# EAGLE design hacker-boards-refactor (EAGLE 7.5.0)
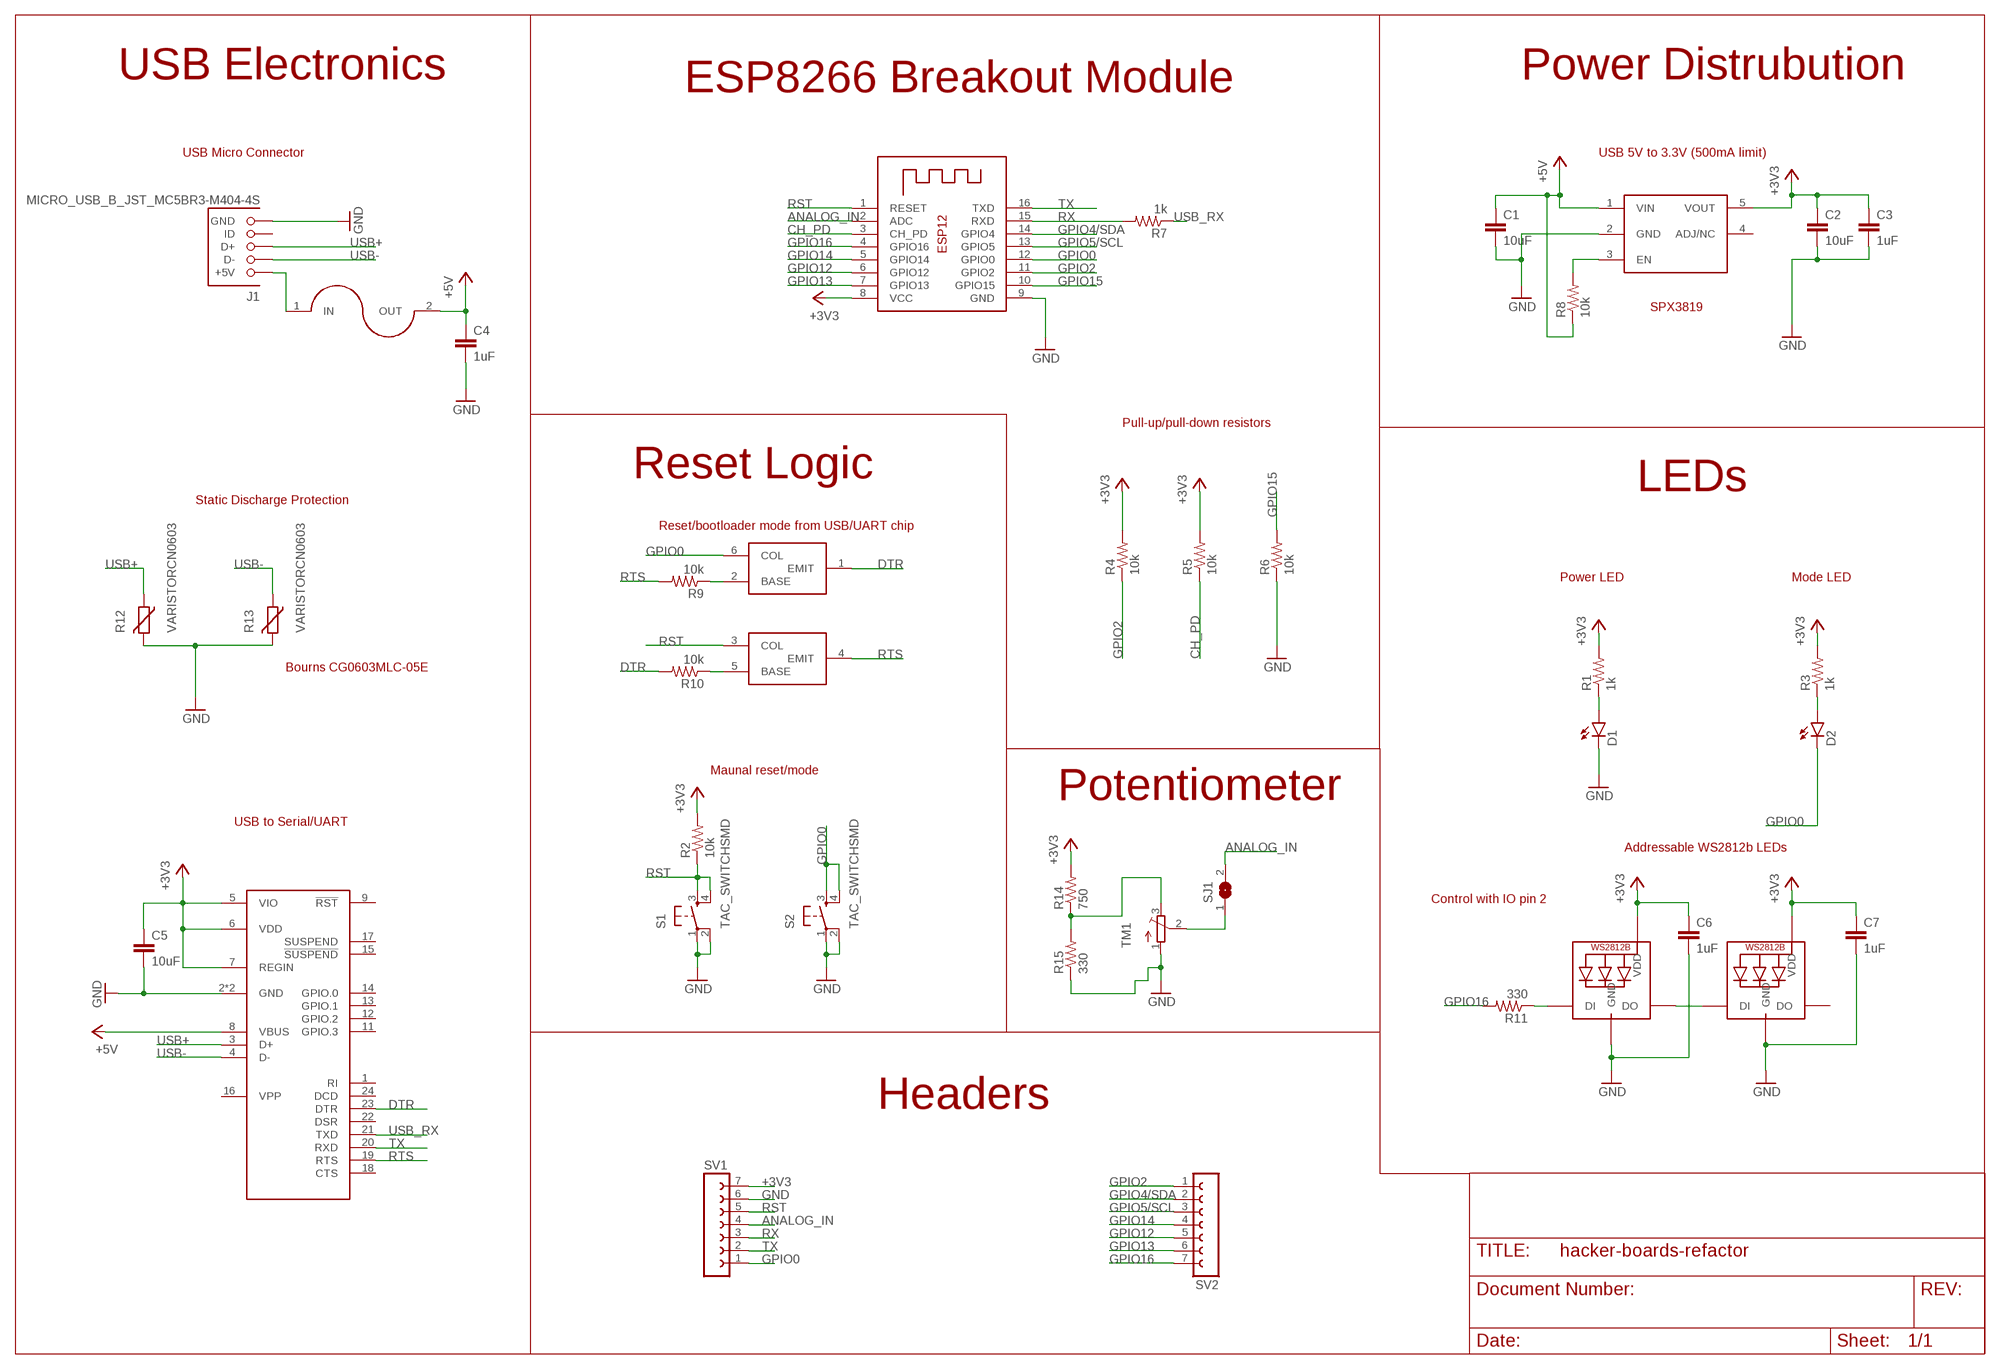
[diagram p0: schematic, sheet 1]

## Parts
C1  10uF  C0805  [C0805]
C2  10uF  C0805  [C0805]
C3  1uF  C0805  [C0805]
C4  1uF  C0805  [C0805]
C5  10uF  C0805  [C0805]
C6  1uF  C0805  [C0805]
C7  1uF  C0805  [C0805]
D1  LED0603  [LED-0603]
D2  LED0603  [LED-0603]
J1  MICRO_USB_B_JST_MC5BR3-M404-4S  [USB_MICRO_B-JST-MC5BR3-M404-4S-TB]
LED1  WS2812B5050  [WS2812B]
LED2  WS2812B5050  [WS2812B]
R1  1k  R-US_R0805  [R0805]
R2  10k  R-US_R0805  [R0805]
R3  1k  R-US_R0805  [R0805]
R4  10k  R-US_R0805  [R0805]
R5  10k  R-US_R0805  [R0805]
R6  10k  R-US_R0805  [R0805]
R7  1k  R-US_R0805  [R0805]
R8  10k  R-US_R0805  [R0805]
R9  10k  R-US_R0805  [R0805]
R10  10k  R-US_R0805  [R0805]
R11  330  R-US_R0805  [R0805]
R12  VARISTORCN0603  [CT/CN0603]
R13  VARISTORCN0603  [CT/CN0603]
R14  750  R-US_R0805  [R0805]
R15  330  R-US_R0805  [R0805]
S1  TAC_SWITCHSMD  [TACTILE-SWITCH-SMD]
S2  TAC_SWITCHSMD  [TACTILE-SWITCH-SMD]
SJ1  SJ  [SJ]
SV1  FE07-1  [FE07]
SV2  FE07-1  [FE07]
TM1  TRIMPOTTC33X  [TC33X]
U$1  USB-FUSE  [L1812]
U$2  AP2112  [SOT23-5L]
U$3  CP2104  [QFN24_4X4]
U$4  MBT3904DW1T1G  [SOT363]
X1  ESP-12  [ESP-12]

## Nets
+3V3: C2.1 C3.1 C5.1 C6.1 C7.1 LED1.1-VDD(VDD) LED2.1-VDD(VDD) R1.2 R2.2 R3.2 R4.2 R5.2 R14.2 SV1.7 U$2.5(VOUT) U$3.5(VIO) U$3.6(VDD) U$3.7(REGIN) X1.8(VCC)
+5V: C1.1 C4.1 R8.1 U$1.2(OUT) U$2.1(VIN) U$3.8(VBUS)
ANALOG_IN: SJ1.2 SV1.4 X1.2(ADC)
CH_PD: R5.1 X1.3(CH_PD)
DTR: R10.2 U$3.23(DTR) U$4.1(EMIT)
GND: C1.2 C2.2 C3.2 C4.2 C5.2 C6.2 C7.2 D1.C J1.5(GND) LED1.3-GND(GND) LED2.3-GND(GND) R6.1 R12.2 R13.2 R15.1 S1.1 S1.2 S2.1 S2.2 SV1.6 TM1.1(A) U$2.2(GND) U$3.2(GND) U$3.25(GND) X1.9(GND)
GPIO0: D2.C S2.3 S2.4 SV1.1 U$4.6(COL) X1.12(GPIO0)
GPIO2: R4.1 SV2.1 X1.11(GPIO2)
GPIO4/SDA: SV2.2 X1.14(GPIO4)
GPIO5/SCL: SV2.3 X1.13(GPIO5)
GPIO12: SV2.5 X1.6(GPIO12)
GPIO13: SV2.6 X1.7(GPIO13)
GPIO14: SV2.4 X1.5(GPIO14)
GPIO15: R6.2 X1.10(GPIO15)
GPIO16: R11.2 SV2.7 X1.4(GPIO16)
N$1: D1.A R1.1
N$2: J1.1(+5V) U$1.1(IN)
N$3: D2.A R3.1
N$4: R14.1 R15.2 TM1.3(E)
N$5: LED1.2-DOUT(DO) LED2.4-DIN(DI)
N$6: LED1.4-DIN(DI) R11.1
N$7: R8.2 U$2.3(EN)
N$8: R9.1 U$4.2(BASE)
N$11: R10.1 U$4.5(BASE)
N$12: SJ1.1 TM1.2(S)
RST: R2.1 S1.3 S1.4 SV1.5 U$4.3(COL) X1.1(RESET)
RTS: R9.2 U$3.19(RTS) U$4.4(EMIT)
RX: R7.2 SV1.3 X1.15(RXD)
TX: SV1.2 U$3.20(RXD) X1.16(TXD)
USB+: J1.3(D+) R12.1 U$3.3(D+)
USB-: J1.2(D-) R13.1 U$3.4(D-)
USB_RX: R7.1 U$3.21(TXD)
Unconnected: J1.4(ID) LED2.2-DOUT(DO) U$2.4(ADJ/NC) U$3.1(RI) U$3.9(!RST) U$3.11(GPIO.3) U$3.12(GPIO.2) U$3.13(GPIO.1) U$3.14(GPIO.0) U$3.15(!SUSPEND) U$3.16(VPP) U$3.17(SUSPEND) U$3.18(CTS) U$3.22(DSR) U$3.24(DCD)

## Notes on the sheet
- USB Electronics | Power Distrubution
- ESP8266 Breakout Module
- USB Micro Connector | USB 5V to 3.3V (500mA limit)
- SPX3819
- Pull-up/pull-down resistors
- Reset Logic
- LEDs
- Static Discharge Protection
- Reset/bootloader mode from USB/UART chip
- Power LED | Mode LED
- Bourns CG0603MLC-05E
- Maunal reset/mode
- Potentiometer
- USB to Serial/UART
- Addressable WS2812b LEDs
- Control with IO pin 2
- Headers

## Library data of the parts
C1-C7 = hacker-board:C
D1 D2 = hacker-board:LED: LEDs Standard schematic elements and footprints for 5mm, 3mm, 1206, and 0603 sized LEDs. 5mm - Spark Fun Electronics SKU : COM-00529 (and others)
J1 = hacker-board:MICRO_USB_B_JST_MC5BR3-M404-4S: Micro USB B mid mount; DIGIKEY: 455-2567-2-ND; MOUSER: 53X3655
LED1 LED2 = hacker-board:WS2812B
R1-R11 R14 R15 = resistor:R-US_: RESISTOR, American symbol
R12 R13 = varistor:VARISTOR: VARISTOR
S1 S2 = hacker-board:TAC_SWITCH: Momentary Switch Button commonly used for reset or general input. Spark Fun Electronics SKU : COM-00097 SMT- SWCH-08247; PROD_ID: SWCH-08247
SJ1 = jumper:SJ: SMD solder JUMPER
SV1 SV2 = con-lsta:FE07-1: FEMALE HEADER; OC_FARNELL: unknown; OC_NEWARK: unknown
TM1 = adafruit:TRIMPOT: SMT trimmer potentiometer part number TC33X http://www.ladyada.net/library/eagle
U$1 = hacker-board:USB-FUSE: MF-MSMF075-2
U$2 = hacker-board:AP2112
U$3 = hacker-board:CP2104
U$4 = hacker-board:MBT3904DW1T1G
X1 = hacker-board:ESP-12

## Board
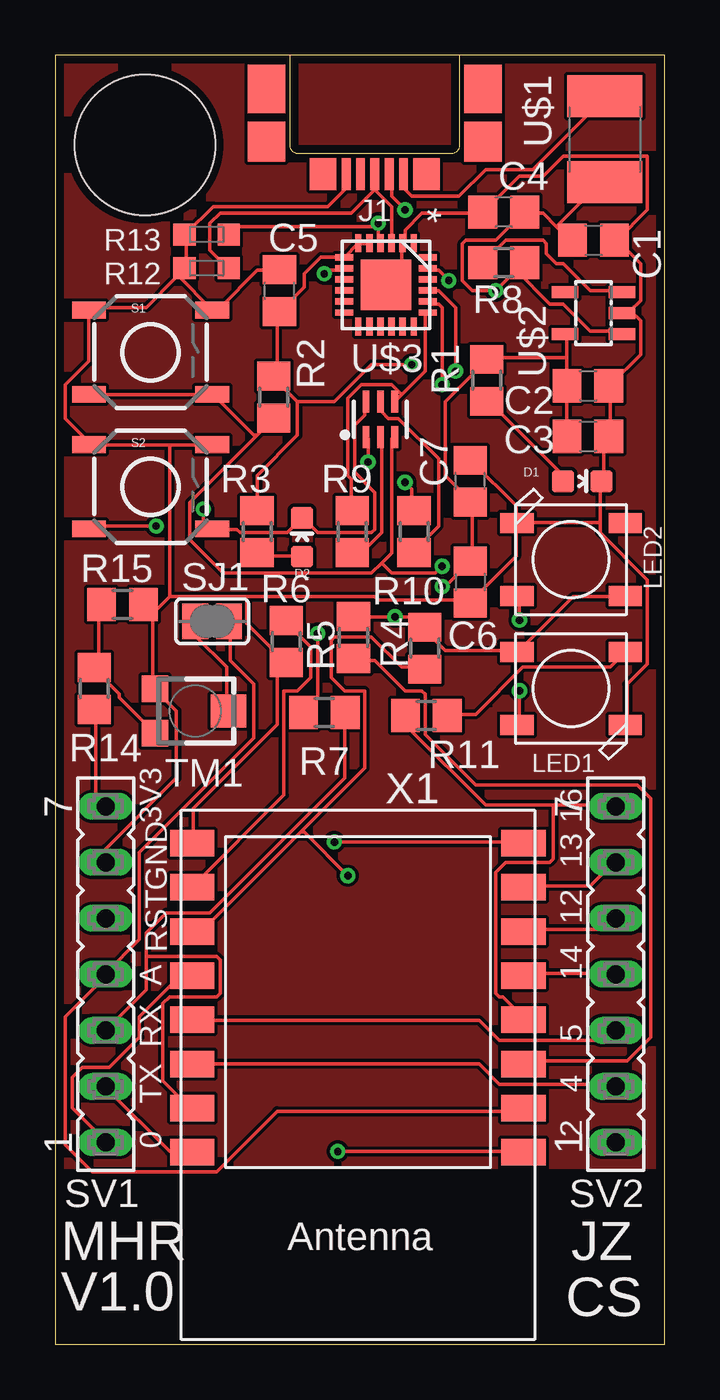
[diagram p1: board, top side]
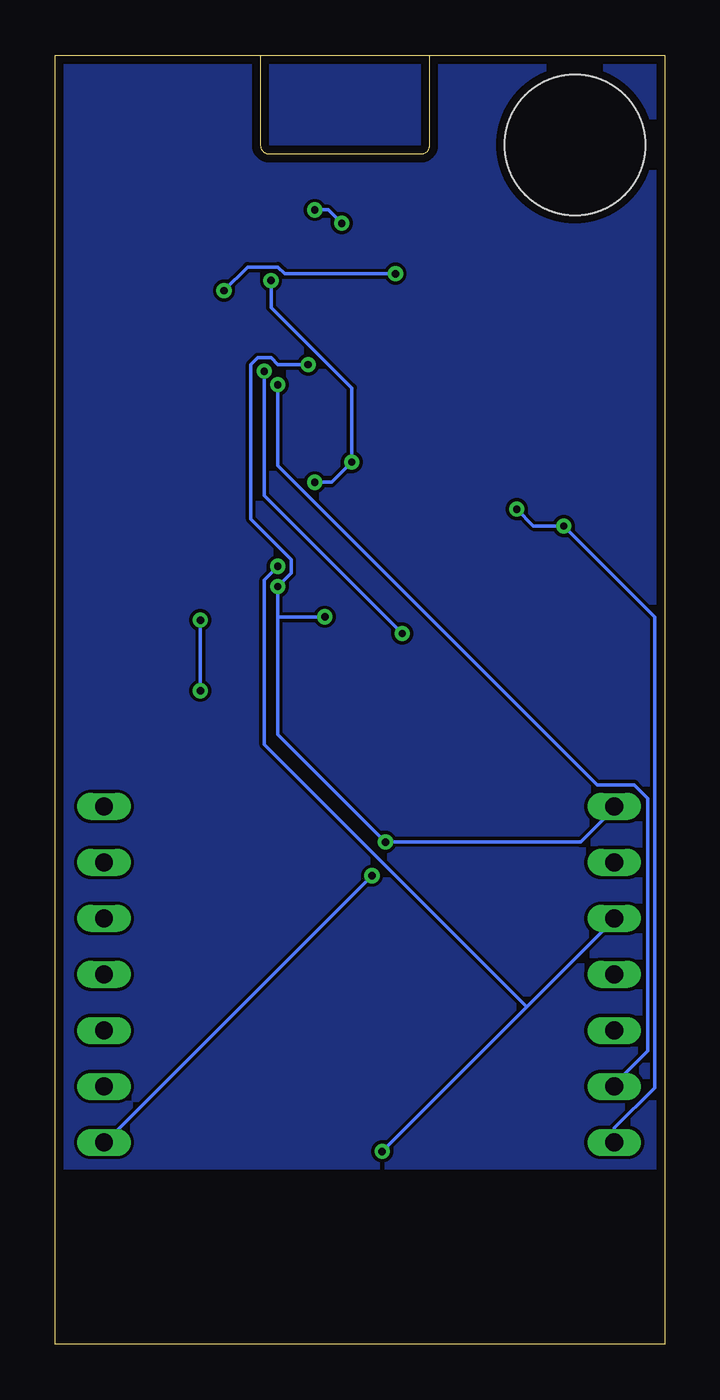
[diagram p2: board, bottom side, seen from below]

Size 27.61 x 58.42 mm. Coordinates in mm from the lower left corner, seen from the top.
Outline: 0,0 27.61,0 27.61,58.41 0,58.41 0,0
Copper layers (1*16): Top 0.0356mm / dielectric 1.5011mm / Bottom 0.0356mm
Design rules "LaenPCBOrder": minimum track width 6mil, minimum drill 13mil, track to track 6mil, track to pad 6mil, pad to pad 6mil, via to via 6mil, smd to smd 6mil, copper to edge 15mil, drill to drill 6mil, minimum pad ring 7mil, minimum via ring 7mil, stop-mask expansion 3mil, vias tented up to drill 0mil, thermal gap 10mil
Holes 6.35 mm at 4.06,54.36

### Footprints (pad centres in the part's own frame; a part is rotated, then mirrored left to right if it is on the bottom)
C0805 = smd 1.3 x 1.5: 1 -0.95,0; 2 0.95,0
LED-0603 = smd 1 x 1: A 0,-0.877; C 0,0.877
USB_MICRO_B-JST-MC5BR3-M404-4S-TB = smd 0.4 x 1.45: 1 -1.3,3.875; 2 -0.65,3.875; 3 0,3.875; 4 0.65,3.875; 5 1.3,3.875 | smd 1.7 x 2.2: P$1 -4.9,0; P$2 4.9,0 | smd 1.7 x 1.8: P$3 -4.9,2.4; P$4 4.9,2.4 | smd 1.2 x 1.45: P$5 -2.35,3.875; P$6 2.35,3.875
WS2812B = smd 1.5 x 0.9: 1-VDD 2.45,-1.65; 2-DOUT 2.45,1.65; 3-GND -2.45,1.65; 4-DIN -2.45,-1.65
R0805 = smd 1.3 x 1.5: 1 -0.95,0; 2 0.95,0
CT/CN0603 = smd 1 x 1: 1 -1,0; 2 1,0
TACTILE-SWITCH-SMD = smd 1.524 x 0.762: 1 -2.794,1.905; 2 2.794,1.905; 3 -2.794,-1.905; 4 2.794,-1.905
SJ = smd 1.168 x 1.6: 1 -0.762,0; 2 0.762,0
FE07 = drill 0.813 long: 1 -7.62,0; 2 -5.08,0; 3 -2.54,0; 4 0,0; 5 2.54,0; 6 5.08,0; 7 7.62,0
TC33X = smd 1.2 x 1.2: 1 -1,-1.825; 3 1,-1.825 | smd 1.5 x 1.6: 2 0,1.5
L1812 = smd 1.9 x 3.4: 1 -1.95,0; 2 1.95,0
SOT23-5L = smd 0.55 x 1.2: 1 -0.95,-1.3; 2 0,-1.3; 3 0.95,-1.3; 4 0.95,1.3; 5 -0.95,1.3
QFN24_4X4 = smd 0.813 x 0.279: 1 -1.892,1.25; 6 -1.892,-1.25; 13 1.892,-1.25; 18 1.892,1.25 | smd 0.813 x 0.305: 2 -1.892,0.75; 3 -1.892,0.25; 4 -1.892,-0.25; 5 -1.892,-0.75; 14 1.892,-0.75; 15 1.892,-0.25; 16 1.892,0.25; 17 1.892,0.75 | smd 0.279 x 0.813: 7 -1.25,-1.892; 12 1.25,-1.892; 19 1.25,1.892; 24 -1.25,1.892 | smd 0.305 x 0.813: 8 -0.75,-1.892; 9 -0.25,-1.892; 10 0.25,-1.892; 11 0.75,-1.892; 20 0.75,1.892; 21 0.25,1.892; 22 -0.25,1.892; 23 -0.75,1.892 | smd 2.286 x 2.286: 25 0,0
SOT363 = smd 0.3 x 0.99: 1 -0.65,-0.8; 2 0,-0.8; 3 0.65,-0.8; 4 0.65,0.81; 5 0,0.81; 6 -0.65,0.81
ESP-12 = smd 2 x 1.2: 1 -7.5,4.5; 2 -7.5,2.5; 3 -7.5,0.5; 4 -7.5,-1.5; 5 -7.5,-3.5; 6 -7.5,-5.5; 7 -7.5,-7.5; 8 -7.5,-9.5; 9 7.5,-9.5; 10 7.5,-7.5; 11 7.5,-5.5; 12 7.5,-3.5; 13 7.5,-1.5; 14 7.5,0.5; 15 7.5,2.5; 16 7.5,4.5

### Placement (x,y rotation side)
C1  24.38,50.04 0 top
C2  24.13,43.43 0 top
C3  24.13,41.15 0 top
C4  20.32,51.31 180 top
C5  10.16,47.75 90 top
C6  18.8,34.54 270 top
C7  18.8,39.12 90 top
D1  23.88,39.12 270 top
D2  11.18,36.58 0 top
J1  14.48,56.9 180 top
LED1  23.37,29.72 180 top
LED2  23.37,35.56 0 top
R1  19.56,43.69 90 top
R2  9.91,42.93 90 top
R3  9.14,36.83 90 top
R4  16.74,31.55 90 top
R5  13.51,32.03 90 top
R6  10.46,31.85 90 top
R7  12.19,28.63 0 top
R8  20.32,49.02 180 top
R9  13.46,36.83 90 top
R10  16.26,36.83 90 top
R11  16.81,28.5 180 top
R12  6.86,48.77 180 top
R13  6.86,50.29 180 top
R14  1.78,29.72 270 top
R15  3.05,33.53 180 top
S1  4.32,44.96 0 top
S2  4.32,38.86 0 top
SJ1  7.11,32.77 0 top
SV1  2.29,16.76 90 top
SV2  25.4,16.76 90 top
TM1  6.35,28.7 270 top
U$1  24.89,54.61 270 top
U$2  24.38,46.74 90 top
U$3  14.99,48.01 270 top
U$4  14.73,41.91 0 top
X1  13.72,13.21 180 top

### Tracks (layer width: path | path; a pad name or v marks a point on that pad's centre or on a via)
+3V3  (via drill 0.33)
  Top 0.152: U$3.5 14.17,49.89 13.87,49.89 U$3.6 13.72,49.89 13.11,49.28 U$3.7 12.95,49.28 12.04,49.28 11.28,48.51 11.28,47.9 10.21,46.84 C5.1 10.06,46.69 10.06,44.09 9.91,43.94 R2.2 9.91,43.79 10.97,42.72 | R3.2 9.14,39.37 10.97,41.2 10.97,42.72 | R5.2 13.56,32.97 v15.39,32.97 16.15,32.97 16.61,32.51 R4.2 16.76,32.36 17.68,31.45 20.88,31.45 LED1.1-VDD 21.03,31.45 23.47,33.88 25.76,33.88 LED2.1-VDD | 23.16,44.7 23.16,43.48 C2.1 23.16,43.33 23.16,41.2 C3.1 | 23.16,44.7 23.16,45.77 U$2.5 | 23.16,44.7 19.66,44.7 R1.2 19.51,44.55 17.68,42.72 17.68,39.37 18.75,38.3 C7.1 18.9,38.15 18.9,35.56 C6.1 18.75,35.41 17.68,34.34 v17.53,34.34 | R14.2 1.83,28.7 1.83,24.89 2.29,24.43 SV1.7 | v12.65,22.76 21.18,22.76 X1.8 | 10.97,42.72 12.65,42.72 14.33,44.4 v16.15,44.4
  Bottom 0.152: SV1.7 2.29,24.28 3.81,22.76 v12.65,22.76 17.53,27.63 17.53,32.97 | 17.53,32.97 v17.53,34.34 16.92,34.95 16.92,35.56 18.75,37.39 18.75,44.4 18.44,44.7 17.83,44.7 17.53,44.4 v16.15,44.4 | 17.53,32.97 v15.39,32.97
+5V  (via drill 0.33)
  Top 0.152: 22.71,50.65 23.32,50.04 C1.1 | 22.71,50.65 22.1,51.26 21.34,51.26 C4.1 21.18,51.26 19.96,50.04 18.59,50.04 18.44,49.89 18.44,48.21 18.9,47.75 v19.96,47.75 20.88,48.67 | 22.71,50.65 24.84,52.78 U$1.2 | v12.19,48.51 12.34,48.67 12.95,48.67 U$3.8 | 20.88,48.67 21.18,48.97 R8.1 20.88,48.67 | 20.88,48.67 22.4,47.14 23.01,47.14 24.23,45.92 25.6,45.92 U$2.1
  Bottom 0.152: v12.19,48.51 17.22,48.51 17.53,48.82 18.9,48.82 v19.96,47.75
ANALOG_IN
  Top 0.152: SJ1.2 7.92,32.66 7.92,30.99 8.99,29.92 8.99,27.48 3.81,22.3 3.81,18.34 2.29,16.81 SV1.4 2.29,16.66 0.46,14.83 0.46,9.04 1.68,7.82 7.32,7.82 10.06,10.57 21.18,10.57 X1.2
CH_PD
  Top 0.152: R5.1 13.56,30.99 14.48,30.99 15.85,29.62 16.61,29.62 16.76,29.46 16.76,27.63 19.05,25.35 26.36,25.35 26.98,24.74 26.98,13.92 25.91,12.85 21.34,12.85 X1.3
DTR  (via drill 0.33)
  Top 0.152: v17.83,48.21 17.37,48.67 16.92,48.67 U$3.23 | v14.17,39.98 14.17,41.05 U$4.1 | v15.85,39.06 16.15,38.76 16.15,37.85 R10.2
  Bottom 0.152: v17.83,48.21 17.83,46.99 14.17,43.33 v14.17,39.98 15.09,39.06 v15.85,39.06
GND
  Top 0.152: U$3.25 15.09,48.06 15.7,48.67 15.7,49.89 U$3.2 15.85,50.04 15.85,50.49 16.61,51.26 19.36,51.26 C4.2 19.51,51.41 21.03,52.93 22.1,52.93 23.01,53.85 26.82,53.85 26.82,51.41 25.45,50.04 | LED2.3-GND 20.88,37.08 20.88,35.71 18.9,33.73 C6.2 18.75,33.73 14.63,33.73 14.48,33.88 8.53,33.88 | C7.2 18.9,39.98 20.88,38 20.88,37.24 LED2.3-GND | 26.06,46.84 25.76,46.84 U$2.2 26.06,46.84 | 26.06,46.84 26.52,47.3 26.52,48.97 25.45,50.04 | 24.69,37.24 24.69,39.06 D1.C 24.84,39.22 24.84,40.89 24.99,41.05 C3.2 25.15,41.2 25.15,43.33 C2.2 25.15,43.48 26.52,44.86 26.52,46.38 26.06,46.84 | 24.69,37.24 24.69,36.78 26.82,34.65 26.82,30.84 25.91,29.92 25.91,28.09 LED1.3-GND | 24.69,37.24 21.03,37.24 LED2.3-GND | 25.45,50.04 C1.2 | C5.2 10.06,48.67 9.14,48.67 7.47,46.99 7.16,46.99 S1.2 7.01,46.99 5.64,48.36 5.49,48.36 | R12.2 5.94,48.82 5.94,50.19 R13.2 5.94,50.34 7.16,51.56 12.34,51.56 13.11,52.32 13.11,52.93 J1.5 | 5.49,48.36 5.79,48.67 R12.2 | 5.49,48.36 4.12,46.99 1.52,46.99 S1.1 1.52,44.55 0.46,43.48 0.46,41.96 1.52,40.89 S2.1 1.52,40.74 5.18,40.74 | 5.49,48.36 R12.2 | 5.18,40.74 7.01,40.74 S2.2 | 4.42,33.12 4.42,29.77 TM1.1 4.57,29.62 5.49,28.7 5.49,25.65 2.29,22.45 SV1.6 | 4.42,33.12 4.12,33.43 R15.1 4.42,33.12 | 8.53,33.88 8.69,33.73 8.69,32.66 10.36,30.99 R6.1 10.36,30.84 10.06,30.53 10.06,28.09 6.25,24.28 6.25,22.76 X1.9 | 5.18,33.88 8.53,33.88 | 4.42,33.12 5.18,33.88 | 5.18,33.88 5.18,40.74
GPIO0  (via drill 0.33)
  Top 0.152: X1.12 6.1,16.66 5.64,16.66 3.81,14.83 3.81,13.92 2.44,12.55 1.22,12.55 0.76,12.09 0.76,10.72 2.29,9.2 SV1.1 | v4.57,37.08 1.52,37.08 S2.3 | v6.71,37.85 6.71,37.39 7.01,37.08 S2.4 7.16,36.93 8.23,36.93 8.38,36.78 10.52,36.78 11.12,37.39 D2.C 11.28,37.39 11.89,36.78 14.33,36.78 14.48,36.93 14.48,38.61 13.56,39.52 13.56,41.66 14.02,42.11 14.02,42.57 U$4.6
  Bottom 0.152: v6.71,37.85 5.94,37.08 v4.57,37.08 0.46,32.97 0.46,11.63 2.29,9.8 SV1.1
GPIO2  (via drill 0.33)
  Top 0.152: 11.12,23.22 6.71,18.8 6.25,18.8 X1.11 | 11.12,23.22 14.02,26.11 14.02,29.62 13.11,29.62 12.5,30.23 12.5,31.9 12.65,32.05 14.33,32.05 15.7,30.68 16.61,30.68 R4.1 | v13.26,21.23 11.28,23.22 11.12,23.22
  Bottom 0.152: v13.26,21.23 25.3,9.2 SV2.1
GPIO4/SDA
  Top 0.152: X1.14 6.25,12.7 19.2,12.7 20.12,11.79 25.3,11.79 SV2.2
GPIO5/SCL
  Top 0.152: X1.13 6.25,14.68 19.2,14.68 20.12,13.77 24.84,13.77 25.3,14.22 SV2.3
GPIO12
  Top 0.152: X1.6 21.34,18.8 24.84,18.8 25.3,19.25 SV2.5
GPIO13
  Top 0.152: X1.7 21.34,20.78 24.23,20.78 25.3,21.84 SV2.6
GPIO14
  Top 0.152: X1.5 21.34,16.81 25.3,16.81 SV2.4
GPIO15
  Top 0.152: R6.2 10.52,32.66 11.58,31.6 11.58,30.23 10.97,29.62 10.36,29.62 10.36,24.89 6.25,20.78 X1.10
GPIO16
  Top 0.152: 22.55,24.43 25.3,24.43 SV2.7 | 22.55,24.43 19.51,24.43 16,27.94 16,28.4 R11.2 | 22.55,24.43 22.55,22 22.4,21.84 20.42,21.84 19.96,21.39 19.96,15.9 20.12,15.75 20.27,15.75 21.18,14.83 X1.4
N$1
  Top 0.152: D1.A 22.86,39.22 22.86,39.52 19.66,42.72 R1.1
N$2
  Top 0.152: J1.1 15.85,52.93 15.85,52.32 16.15,52.02 18.29,52.02 19.51,53.24 21.64,53.24 24.84,56.44 U$1.1
N$3
  Top 0.152: D2.A 11.12,35.71 9.3,35.71 9.14,35.86 R3.1
N$4
  Top 0.152: TM1.3 4.42,27.79 2.9,29.31 2.9,29.46 1.83,30.53 R14.1 1.83,30.68 1.98,30.84 1.98,33.43 R15.2
N$5  (via drill 0.33)
  Top 0.152: v21.03,29.62 21.03,28.09 LED1.2-DOUT | v21.03,32.82 21.03,33.88 LED2.4-DIN
  Bottom 0.152: v21.03,32.82 v21.03,29.62
N$6
  Top 0.152: R11.1 17.83,28.55 19.05,28.55 21.18,30.68 25.15,30.68 25.76,31.29 LED1.4-DIN
N$7
  Top 0.152: U$2.3 25.6,47.75 24.23,47.75 23.01,48.97 22.71,48.97 22.25,49.43 22.25,49.89 22.1,50.04 20.42,50.04 19.51,49.12 R8.2
N$8
  Top 0.152: U$4.2 14.78,41.05 14.78,36.78 14.02,36.02 13.56,36.02 R9.1
N$9
  pour Top: 0,58.42 27.69,58.42 27.69,8.13 0,8.13
N$10
  pour Bottom: 0,58.42 27.69,58.42 27.69,8.13 0,8.13
N$11
  Top 0.152: U$4.5 14.78,42.57 14.78,42.27 15.09,41.96 15.54,41.96 17.37,40.13 17.37,37.08 16.31,36.02 R10.1
N$12
  Top 0.152: TM1.2 7.77,28.7 7.77,30.68 6.4,32.05 6.4,32.66 SJ1.1
RST  (via drill 0.33)
  Top 0.152: S1.3 1.52,43.03 7.01,43.03 S1.4 7.16,43.03 8.99,41.2 9.14,41.2 | 14.78,35.41 14.33,34.95 7.62,34.95 6.1,36.47 6.1,38.15 9.14,41.2 | 14.78,35.41 15.24,35.86 15.24,41.05 U$4.3 | 9.14,41.2 9.91,41.96 R2.1 | v12.8,8.74 21.18,8.74 X1.1 | 14.78,35.41 15.24,34.95 17.22,34.95 v17.53,35.25
  Bottom 0.152: 6.25,15.29 2.29,19.25 SV1.5 | 6.25,15.29 v12.8,8.74 | v17.53,35.25 18.14,34.65 18.14,27.18 6.25,15.29
RTS
  Top 0.152: 15.7,43.03 15.39,42.72 U$4.4 | 15.7,43.03 16.76,44.09 16.76,46.69 U$3.19 | 15.7,43.03 15.24,43.48 13.87,43.48 13.26,42.88 13.26,39.37 13.41,39.22 13.41,37.85 R9.2
RX
  Top 0.152: 4.12,17.58 4.12,16.05 SV1.3 | 4.12,17.58 4.12,18.64 5.03,19.56 7.01,19.56 13.11,25.65 13.11,28.55 R7.2 | 4.12,17.58 7.32,17.58 7.47,17.42 7.47,15.9 7.32,15.75 5.18,15.75 4.88,15.44 4.88,11.94 6.1,10.72 X1.15
TX  (via drill 0.33)
  Top 0.152: v17.53,43.48 17.53,46.99 17.37,47.14 16.92,47.14 U$3.20 | X1.16 6.1,8.74 5.18,8.74 2.29,11.63 SV1.2
  Bottom 0.152: v17.53,43.48 17.53,39.83 3.05,25.35 1.37,25.35 0.76,24.74 0.76,13.31 2.29,11.79 SV1.2
USB+
  Top 0.152: 14.48,52.32 15.24,51.56 15.24,50.04 U$3.3 | 14.48,52.32 J1.3 14.48,52.93 | 14.48,52.32 13.41,51.26 7.47,51.26 7.01,50.8 7.01,49.58 7.77,48.82 R12.1
USB-  (via drill 0.33)
  Top 0.152: 14.48,50.65 14.63,50.49 14.63,50.04 U$3.4 | 14.48,50.65 8.23,50.65 7.92,50.34 R13.1 | v15.85,51.41 15.24,52.02 15.24,52.93 J1.2 | 14.48,50.65 v14.63,50.8
  Bottom 0.152: v15.85,51.41 15.24,51.41 v14.63,50.8
USB_RX  (via drill 0.33)
  Top 0.152: v18.14,44.09 18.14,46.99 17.37,47.75 16.92,47.75 U$3.21 | v11.89,32.21 11.89,29.31 11.28,28.7 R7.1
  Bottom 0.152: v18.14,44.09 18.14,38.46 v11.89,32.21

### Text on the board
tNames: 3V3 | 16 | 13 | GND | 12 | RST | A | 14 | RX | 5 | TX | 4 | 0 | 2 | MHR | JZ | V1.0 | CS